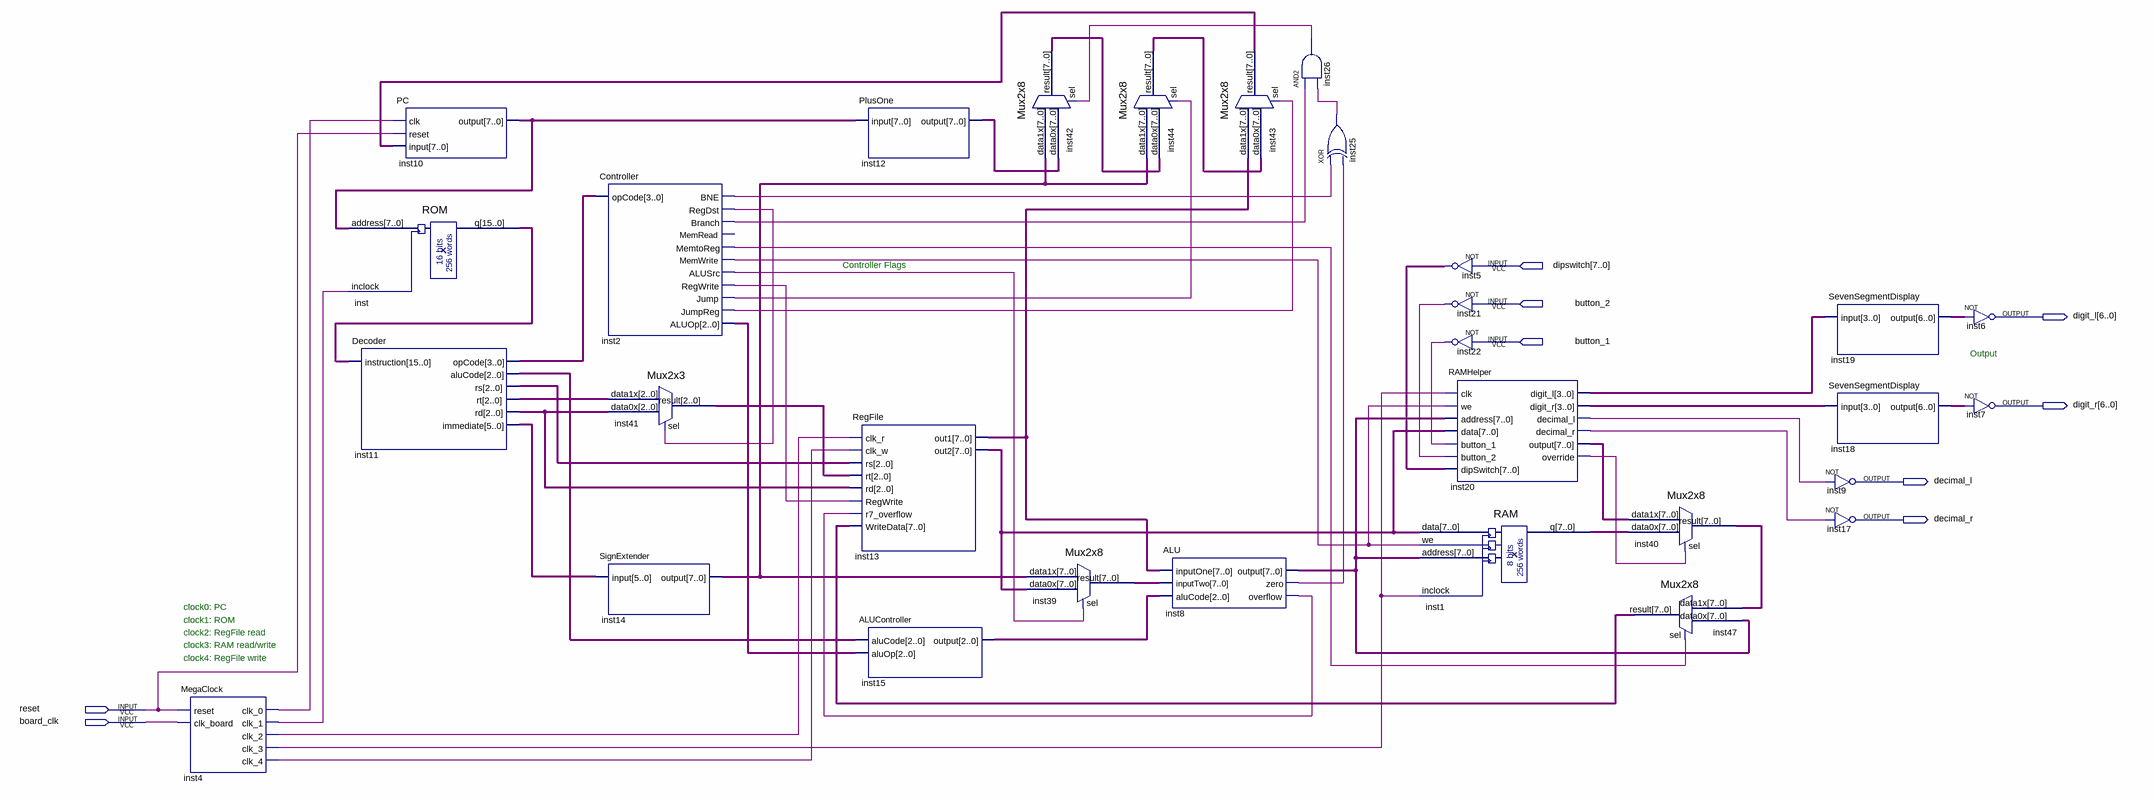
[diagram p0: schematic sheet]
// Quartus schematic FinalProcessor.bdf as structural Verilog: 30 symbols, 9 pins
module FinalProcessor (
  input  [7:0] dipswitch,
  input  button_2,
  input  button_1,
  input  reset,
  input  board_clk,
  output [6:0] digit_l,
  output [6:0] digit_r,
  output decimal_l,
  output decimal_r
);

  wire inst2_alusrc, inst2_bne, inst2_branch, inst2_memtoreg, inst2_memwrite, inst2_regdst, inst2_regwrite,
       inst4_clk_0, inst4_clk_1, inst4_clk_2, inst4_clk_3, inst4_clk_4, inst8_overflow, inst20_decimal_l,
       inst20_decimal_r, inst20_override, inst21_out, inst22_out, inst25_out, inst26_out, JumpReg, RegWrite,
       zero;
  wire [2:0] inst2_aluop, inst11_alucode, inst11_rd, inst11_rs, inst11_rt, inst15_output, inst41_result;
  wire [3:0] inst20_digit_l, inst20_digit_r, opCode;
  wire [5:0] inst11_immediate;
  wire [6:0] inst18_output, inst19_output;
  wire [7:0] inst1_q, inst5_out, inst8_output, inst10_output, inst12_output, inst13_out1, inst13_out2,
       inst14_output, inst20_output, inst39_result, inst40_result, inst42_result, inst43_result,
       inst44_result, inst47_result;
  wire [15:0] inst_q;

  MegaClock inst4 (
    .reset(reset), .clk_board(board_clk), .clk_0(inst4_clk_0), .clk_1(inst4_clk_1), .clk_2(inst4_clk_2),
    .clk_3(inst4_clk_3), .clk_4(inst4_clk_4));
  ROM inst (.address(inst10_output), .inclock(inst4_clk_1), .q(inst_q));
  Decoder inst11 (
    .instruction(inst_q), .opCode(opCode), .aluCode(inst11_alucode), .rs(inst11_rs), .rt(inst11_rt),
    .rd(inst11_rd), .immediate(inst11_immediate));
  PC inst10 (.clk(inst4_clk_0), .reset(reset), .\input (inst43_result), .\output (inst10_output));
  Controller inst2 (
    .opCode(opCode), .BNE(inst2_bne), .RegDst(inst2_regdst), .Branch(inst2_branch),
    .MemtoReg(inst2_memtoreg), .MemWrite(inst2_memwrite), .ALUSrc(inst2_alusrc), .RegWrite(inst2_regwrite),
    .Jump(RegWrite), .JumpReg(JumpReg), .ALUOp(inst2_aluop));  // open: MemRead
  Mux2x3 inst41 (.data1x(inst11_rt), .data0x(inst11_rd), .sel(inst2_regdst), .result(inst41_result));
  SignExtender inst14 (.\input (inst11_immediate), .\output (inst14_output));
  PlusOne inst12 (.\input (inst10_output), .\output (inst12_output));
  RegFile inst13 (
    .clk_r(inst4_clk_2), .clk_w(inst4_clk_4), .rs(inst11_rs), .rt(inst41_result), .rd(inst11_rd),
    .RegWrite(inst2_regwrite), .r7_overflow(inst8_overflow), .WriteData(inst47_result), .out1(inst13_out1),
    .out2(inst13_out2));
  ALUController inst15 (.aluCode(inst11_alucode), .aluOp(inst2_aluop), .\output (inst15_output));
  Mux2x8 inst42 (.data1x(inst14_output), .data0x(inst12_output), .sel(inst26_out), .result(inst42_result));
  Mux2x8 inst39 (.data1x(inst14_output), .data0x(inst13_out2), .sel(inst2_alusrc), .result(inst39_result));
  Mux2x8 inst44 (.data1x(inst14_output), .data0x(inst42_result), .sel(RegWrite), .result(inst44_result));
  ALU inst8 (
    .inputOne(inst13_out1), .inputTwo(inst39_result), .aluCode(inst15_output), .\output (inst8_output),
    .zero(zero), .overflow(inst8_overflow));
  Mux2x8 inst43 (.data1x(inst13_out1), .data0x(inst44_result), .sel(JumpReg), .result(inst43_result));
  and inst26 (inst26_out, inst2_branch, inst25_out);
  xor inst25 (inst25_out, inst2_bne, zero);
  assign inst5_out = ~dipswitch;  // NOT inst5, 8 bits wide
  not inst21 (inst21_out, button_2);
  not inst22 (inst22_out, button_1);
  RAMHelper inst20 (
    .clk(inst4_clk_3), .we(inst2_memwrite), .address(inst8_output), .data(inst13_out2),
    .button_1(inst22_out), .button_2(inst21_out), .dipSwitch(inst5_out), .digit_l(inst20_digit_l),
    .digit_r(inst20_digit_r), .decimal_l(inst20_decimal_l), .decimal_r(inst20_decimal_r),
    .\output (inst20_output), .override(inst20_override));
  RAM inst1 (.data(inst13_out2), .we(inst2_memwrite), .address(inst8_output), .inclock(inst4_clk_3), .q(inst1_q));
  Mux2x8 inst40 (.data1x(inst20_output), .data0x(inst1_q), .sel(inst20_override), .result(inst40_result));
  Mux2x8 inst47 (.data1x(inst40_result), .data0x(inst8_output), .sel(inst2_memtoreg), .result(inst47_result));
  SevenSegmentDisplay inst19 (.\input (inst20_digit_l), .\output (inst19_output));
  SevenSegmentDisplay inst18 (.\input (inst20_digit_r), .\output (inst18_output));
  not inst9 (decimal_l, inst20_decimal_l);
  not inst17 (decimal_r, inst20_decimal_r);
  assign digit_l = ~inst19_output;  // NOT inst6, 7 bits wide
  assign digit_r = ~inst18_output;  // NOT inst7, 7 bits wide

  // Notes on the sheet:
  //   Controller Flags
  //   Output
  //   clock0: PC
  //   clock1: ROM
  //   clock2: RegFile read
  //   clock3: RAM read/write
  //   clock4: RegFile write
endmodule
